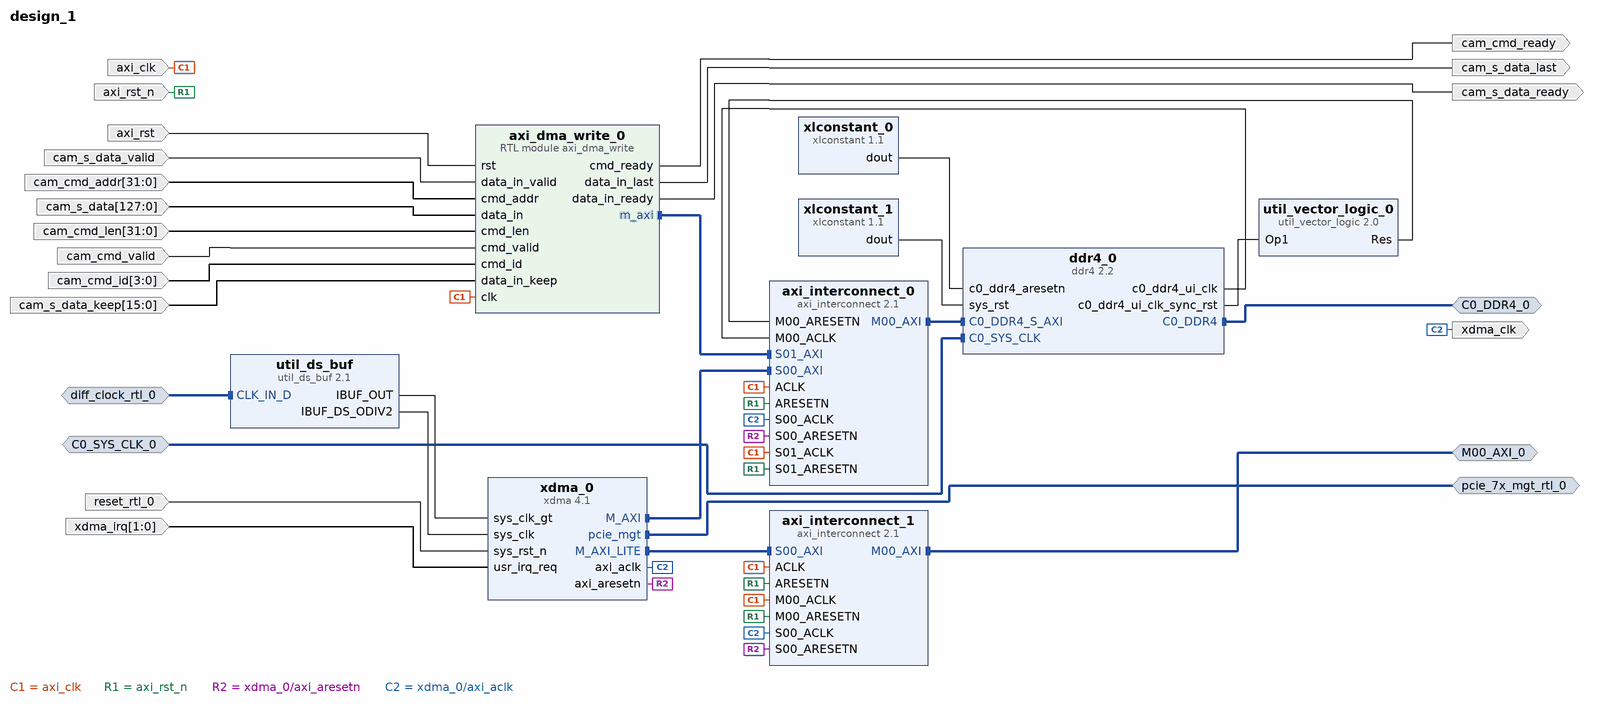
[diagram p0: block diagram of the top level]
# Vivado block design design_1, xcku5p-ffvb676-2-i, Vivado 2020.2
create_bd_design design_1

create_bd_intf_port -mode Master -vlnv xilinx.com:interface:pcie_7x_mgt_rtl:1.0 pcie_7x_mgt_rtl_0
create_bd_intf_port -mode Slave -vlnv xilinx.com:interface:diff_clock_rtl:1.0 diff_clock_rtl_0
set_property -dict {CONFIG.FREQ_HZ 100000000} [get_bd_intf_ports diff_clock_rtl_0]
create_bd_intf_port -mode Slave -vlnv xilinx.com:interface:diff_clock_rtl:1.0 C0_SYS_CLK_0
create_bd_intf_port -mode Master -vlnv xilinx.com:interface:ddr4_rtl:1.0 C0_DDR4_0
create_bd_intf_port -mode Master -vlnv xilinx.com:interface:aximm_rtl:1.0 M00_AXI_0
set_property -dict [list \
  CONFIG.ADDR_WIDTH 32 \
  CONFIG.DATA_WIDTH 32 \
  CONFIG.FREQ_HZ 200000000 \
  CONFIG.HAS_BURST 0 \
  CONFIG.HAS_CACHE 0 \
  CONFIG.HAS_LOCK 0 \
  CONFIG.HAS_QOS 0 \
  CONFIG.HAS_REGION 0 \
  CONFIG.PROTOCOL AXI4LITE \
] [get_bd_intf_ports M00_AXI_0]
create_bd_port -dir I -type rst reset_rtl_0
set_property -dict {CONFIG.POLARITY ACTIVE_LOW} [get_bd_ports reset_rtl_0]
create_bd_port -dir I -type clk axi_clk
set_property -dict {CONFIG.FREQ_HZ 200000000} [get_bd_ports axi_clk]
create_bd_port -dir I -type rst axi_rst
set_property -dict {CONFIG.POLARITY ACTIVE_HIGH} [get_bd_ports axi_rst]
create_bd_port -dir I -type rst axi_rst_n
create_bd_port -dir O -type clk xdma_clk
set_property -dict {CONFIG.FREQ_HZ 125000000} [get_bd_ports xdma_clk]
create_bd_port -dir I cam_s_data_valid
create_bd_port -dir I -from 31 -to 0 cam_cmd_addr
create_bd_port -dir I -from 127 -to 0 cam_s_data
create_bd_port -dir I -from 31 -to 0 cam_cmd_len
create_bd_port -dir I cam_cmd_valid
create_bd_port -dir I -from 3 -to 0 cam_cmd_id
create_bd_port -dir O cam_cmd_ready
create_bd_port -dir I -from 15 -to 0 cam_s_data_keep
create_bd_port -dir O cam_s_data_last
create_bd_port -dir O cam_s_data_ready
create_bd_port -dir I -from 1 -to 0 xdma_irq

create_bd_cell -type ip -vlnv xilinx.com:ip:ddr4:2.2 ddr4_0
set_property -dict [list \
  CONFIG.C0.BANK_GROUP_WIDTH 1 \
  CONFIG.C0.DDR4_AxiAddressWidth 31 \
  CONFIG.C0.DDR4_AxiDataWidth 256 \
  CONFIG.C0.DDR4_CasLatency 19 \
  CONFIG.C0.DDR4_DataWidth 32 \
  CONFIG.C0.DDR4_InputClockPeriod 5000 \
  CONFIG.C0.DDR4_MemoryPart MT40A512M16LY-075 \
] [get_bd_cells ddr4_0]
create_bd_cell -type ip -vlnv xilinx.com:ip:xdma:4.1 xdma_0
set_property -dict [list \
  CONFIG.PF0_DEVICE_ID_mqdma 9034 \
  CONFIG.PF2_DEVICE_ID_mqdma 9034 \
  CONFIG.PF3_DEVICE_ID_mqdma 9034 \
  CONFIG.axi_data_width 256_bit \
  CONFIG.axilite_master_en true \
  CONFIG.axisten_freq 125 \
  CONFIG.pciebar2axibar_axil_master 0x80000000 \
  CONFIG.pf0_device_id 9034 \
  CONFIG.pf0_msi_cap_multimsgcap 1_vector \
  CONFIG.pl_link_cap_max_link_speed 8.0_GT/s \
  CONFIG.pl_link_cap_max_link_width X4 \
  CONFIG.plltype QPLL1 \
  CONFIG.xdma_axi_intf_mm AXI_Memory_Mapped \
  CONFIG.xdma_num_usr_irq 2 \
] [get_bd_cells xdma_0]
create_bd_cell -type ip -vlnv xilinx.com:ip:util_ds_buf:2.1 util_ds_buf
set_property -dict {CONFIG.C_BUF_TYPE IBUFDSGTE} [get_bd_cells util_ds_buf]
create_bd_cell -type ip -vlnv xilinx.com:ip:axi_interconnect:2.1 axi_interconnect_0
set_property -dict [list \
  CONFIG.NUM_MI 1 \
  CONFIG.NUM_SI 2 \
  CONFIG.S00_HAS_DATA_FIFO 2 \
  CONFIG.S01_HAS_DATA_FIFO 2 \
  CONFIG.STRATEGY 2 \
] [get_bd_cells axi_interconnect_0]
create_bd_cell -type module -reference axi_dma_write axi_dma_write_0
set_property -dict {CONFIG.BURST_LEN 64} [get_bd_cells axi_dma_write_0]
create_bd_cell -type ip -vlnv xilinx.com:ip:util_vector_logic:2.0 util_vector_logic_0
set_property -dict {CONFIG.C_OPERATION not CONFIG.C_SIZE 1} [get_bd_cells util_vector_logic_0]
create_bd_cell -type ip -vlnv xilinx.com:ip:xlconstant:1.1 xlconstant_0
create_bd_cell -type ip -vlnv xilinx.com:ip:xlconstant:1.1 xlconstant_1
set_property -dict {CONFIG.CONST_VAL 0} [get_bd_cells xlconstant_1]
create_bd_cell -type ip -vlnv xilinx.com:ip:axi_interconnect:2.1 axi_interconnect_1
set_property -dict {CONFIG.NUM_MI 1} [get_bd_cells axi_interconnect_1]

# ---- connections ----

connect_bd_intf_net [get_bd_intf_ports M00_AXI_0] [get_bd_intf_pins axi_interconnect_1/M00_AXI]
connect_bd_intf_net [get_bd_intf_pins axi_dma_write_0/m_axi] [get_bd_intf_pins axi_interconnect_0/S01_AXI]
connect_bd_intf_net [get_bd_intf_ports pcie_7x_mgt_rtl_0] [get_bd_intf_pins xdma_0/pcie_mgt]
connect_bd_intf_net [get_bd_intf_ports C0_DDR4_0] [get_bd_intf_pins ddr4_0/C0_DDR4]
connect_bd_intf_net -intf_net diff_clock_rtl_0_1 [get_bd_intf_ports diff_clock_rtl_0] [get_bd_intf_pins util_ds_buf/CLK_IN_D]
connect_bd_intf_net [get_bd_intf_pins xdma_0/M_AXI_LITE] [get_bd_intf_pins axi_interconnect_1/S00_AXI]
connect_bd_intf_net [get_bd_intf_pins axi_interconnect_0/S00_AXI] [get_bd_intf_pins xdma_0/M_AXI]
connect_bd_intf_net [get_bd_intf_pins axi_interconnect_0/M00_AXI] [get_bd_intf_pins ddr4_0/C0_DDR4_S_AXI]
connect_bd_intf_net -intf_net C0_SYS_CLK_0_1 [get_bd_intf_ports C0_SYS_CLK_0] [get_bd_intf_pins ddr4_0/C0_SYS_CLK]
connect_bd_net -net reset_rtl_0_1 [get_bd_ports reset_rtl_0] [get_bd_pins xdma_0/sys_rst_n]
connect_bd_net [get_bd_pins util_ds_buf/IBUF_OUT] [get_bd_pins xdma_0/sys_clk_gt]
connect_bd_net [get_bd_pins util_ds_buf/IBUF_DS_ODIV2] [get_bd_pins xdma_0/sys_clk]
connect_bd_net [get_bd_ports axi_clk] \
  [get_bd_pins axi_dma_write_0/clk] [get_bd_pins axi_interconnect_0/ACLK] [get_bd_pins axi_interconnect_0/S01_ACLK] \
  [get_bd_pins axi_interconnect_1/ACLK] [get_bd_pins axi_interconnect_1/M00_ACLK]
connect_bd_net [get_bd_ports axi_rst] [get_bd_pins axi_dma_write_0/rst]
connect_bd_net [get_bd_ports axi_rst_n] \
  [get_bd_pins axi_interconnect_0/ARESETN] [get_bd_pins axi_interconnect_0/S01_ARESETN] \
  [get_bd_pins axi_interconnect_1/ARESETN] [get_bd_pins axi_interconnect_1/M00_ARESETN]
connect_bd_net -net S00_ARESETN_1 [get_bd_pins xdma_0/axi_aresetn] \
  [get_bd_pins axi_interconnect_0/S00_ARESETN] [get_bd_pins axi_interconnect_1/S00_ARESETN]
connect_bd_net -net M00_ACLK_1 [get_bd_pins ddr4_0/c0_ddr4_ui_clk] [get_bd_pins axi_interconnect_0/M00_ACLK]
connect_bd_net [get_bd_pins ddr4_0/c0_ddr4_ui_clk_sync_rst] [get_bd_pins util_vector_logic_0/Op1]
connect_bd_net [get_bd_pins util_vector_logic_0/Res] [get_bd_pins axi_interconnect_0/M00_ARESETN]
connect_bd_net [get_bd_pins xlconstant_0/dout] [get_bd_pins ddr4_0/c0_ddr4_aresetn]
connect_bd_net [get_bd_pins xlconstant_1/dout] [get_bd_pins ddr4_0/sys_rst]
connect_bd_net [get_bd_pins xdma_0/axi_aclk] \
  [get_bd_ports xdma_clk] [get_bd_pins axi_interconnect_0/S00_ACLK] [get_bd_pins axi_interconnect_1/S00_ACLK]
connect_bd_net -net data_in_valid_0_1 [get_bd_ports cam_s_data_valid] [get_bd_pins axi_dma_write_0/data_in_valid]
connect_bd_net -net cmd_addr_0_1 [get_bd_ports cam_cmd_addr] [get_bd_pins axi_dma_write_0/cmd_addr]
connect_bd_net -net data_in_0_1 [get_bd_ports cam_s_data] [get_bd_pins axi_dma_write_0/data_in]
connect_bd_net -net cmd_len_0_1 [get_bd_ports cam_cmd_len] [get_bd_pins axi_dma_write_0/cmd_len]
connect_bd_net -net cmd_valid_0_1 [get_bd_ports cam_cmd_valid] [get_bd_pins axi_dma_write_0/cmd_valid]
connect_bd_net -net cmd_id_0_1 [get_bd_ports cam_cmd_id] [get_bd_pins axi_dma_write_0/cmd_id]
connect_bd_net [get_bd_pins axi_dma_write_0/cmd_ready] [get_bd_ports cam_cmd_ready]
connect_bd_net -net data_in_keep_0_1 [get_bd_ports cam_s_data_keep] [get_bd_pins axi_dma_write_0/data_in_keep]
connect_bd_net [get_bd_pins axi_dma_write_0/data_in_last] [get_bd_ports cam_s_data_last]
connect_bd_net [get_bd_pins axi_dma_write_0/data_in_ready] [get_bd_ports cam_s_data_ready]
connect_bd_net -net usr_irq_req_0_1 [get_bd_ports xdma_irq] [get_bd_pins xdma_0/usr_irq_req]

# ---- address map ----
assign_bd_address -offset 0x00000000 -range 2G -target_address_space [get_bd_addr_spaces axi_dma_write_0/m_axi] [get_bd_addr_segs ddr4_0/C0_DDR4_MEMORY_MAP/C0_DDR4_ADDRESS_BLOCK]
assign_bd_address -offset 0x0000000000000000 -range 2G -target_address_space [get_bd_addr_spaces xdma_0/M_AXI] [get_bd_addr_segs ddr4_0/C0_DDR4_MEMORY_MAP/C0_DDR4_ADDRESS_BLOCK]
assign_bd_address -offset 0x80000000 -range 1M -target_address_space [get_bd_addr_spaces xdma_0/M_AXI_LITE] [get_bd_addr_segs M00_AXI_0/Reg]

validate_bd_design
save_bd_design
